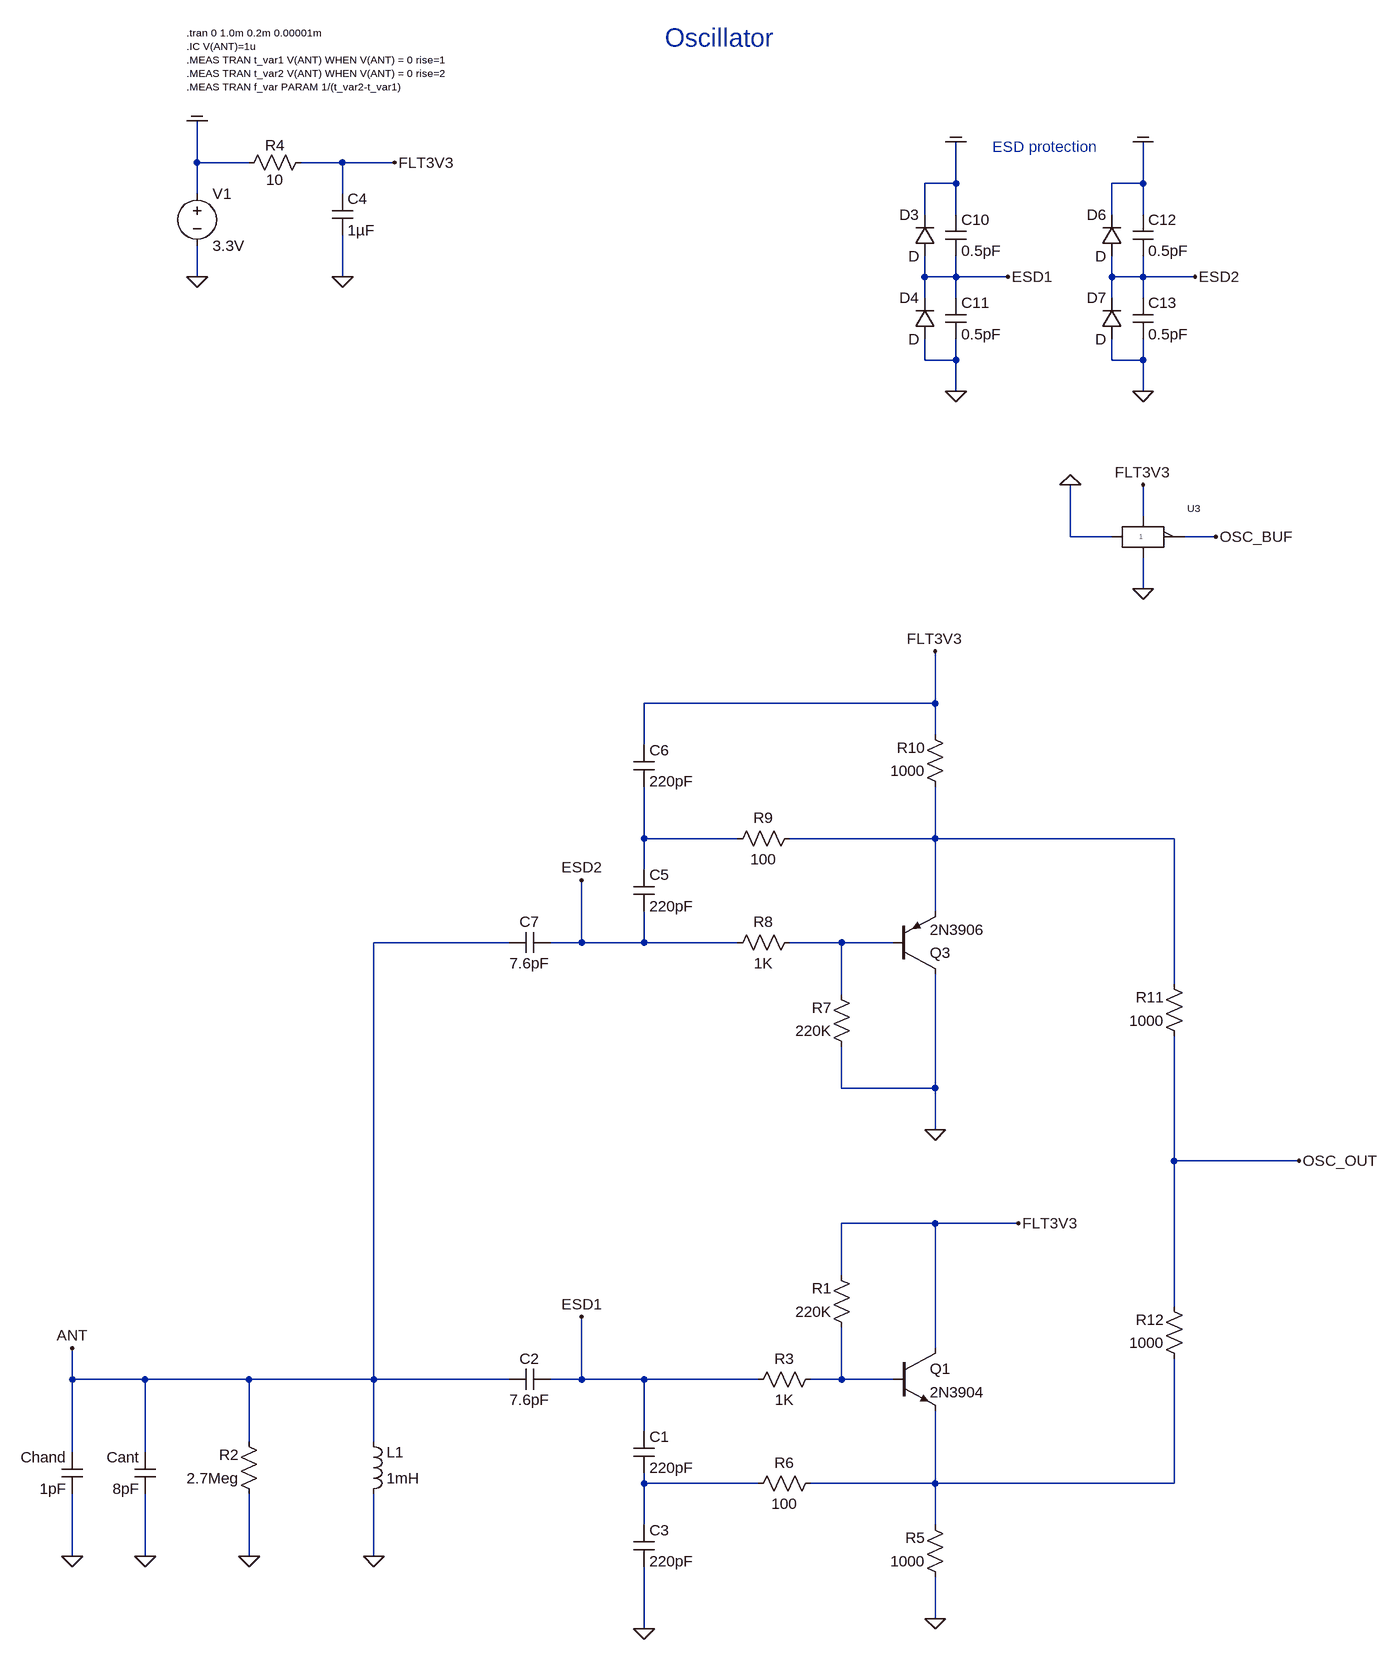
[diagram p0: schematic 2020_npn_osc_v2.asc]
2020_npn_osc_v2.asc, the LTspice schematic file:
Version 4
SHEET 1 2908 1940
WIRE -1056 -336 -1056 -400
WIRE -976 -336 -1056 -336
WIRE -832 -336 -896 -336
WIRE -752 -336 -832 -336
WIRE 112 -304 112 -368
WIRE 112 -304 64 -304
WIRE 400 -304 400 -368
WIRE 400 -304 352 -304
WIRE -1056 -288 -1056 -336
WIRE -832 -288 -832 -336
WIRE 64 -256 64 -304
WIRE 112 -256 112 -304
WIRE 352 -256 352 -304
WIRE 400 -256 400 -304
WIRE -1056 -160 -1056 -208
WIRE -832 -160 -832 -224
WIRE 64 -160 64 -192
WIRE 112 -160 112 -192
WIRE 112 -160 64 -160
WIRE 192 -160 112 -160
WIRE 352 -160 352 -192
WIRE 400 -160 400 -192
WIRE 400 -160 352 -160
WIRE 480 -160 400 -160
WIRE 64 -128 64 -160
WIRE 112 -128 112 -160
WIRE 352 -128 352 -160
WIRE 400 -128 400 -160
WIRE 64 -32 64 -64
WIRE 112 -32 112 -64
WIRE 112 -32 64 -32
WIRE 352 -32 352 -64
WIRE 400 -32 400 -64
WIRE 400 -32 352 -32
WIRE 112 16 112 -32
WIRE 400 16 400 -32
WIRE 400 208 400 160
WIRE 288 240 288 160
WIRE 352 240 288 240
WIRE 512 240 464 240
WIRE 400 320 400 272
WIRE 80 496 80 416
WIRE 80 496 -368 496
WIRE 80 544 80 496
WIRE -368 560 -368 496
WIRE -368 704 -368 624
WIRE -224 704 -368 704
WIRE 80 704 80 624
WIRE 80 704 -144 704
WIRE 448 704 80 704
WIRE -368 752 -368 704
WIRE 80 816 80 704
WIRE -576 864 -784 864
WIRE -464 864 -464 768
WIRE -464 864 -512 864
WIRE -368 864 -368 816
WIRE -368 864 -464 864
WIRE -224 864 -368 864
WIRE -64 864 -144 864
WIRE 16 864 -64 864
WIRE 448 928 448 704
WIRE -64 944 -64 864
WIRE -64 1088 -64 1024
WIRE 80 1088 80 912
WIRE 80 1088 -64 1088
WIRE 80 1152 80 1088
WIRE 448 1200 448 1008
WIRE 640 1200 448 1200
WIRE 80 1296 -64 1296
WIRE 208 1296 80 1296
WIRE -64 1376 -64 1296
WIRE 448 1424 448 1200
WIRE 80 1488 80 1296
WIRE -1248 1536 -1248 1488
WIRE -1136 1536 -1248 1536
WIRE -976 1536 -1136 1536
WIRE -784 1536 -784 864
WIRE -784 1536 -976 1536
WIRE -576 1536 -784 1536
WIRE -464 1536 -464 1440
WIRE -464 1536 -512 1536
WIRE -368 1536 -464 1536
WIRE -192 1536 -368 1536
WIRE -64 1536 -64 1456
WIRE -64 1536 -112 1536
WIRE 16 1536 -64 1536
WIRE -368 1616 -368 1536
WIRE -976 1632 -976 1536
WIRE -784 1632 -784 1536
WIRE -1248 1648 -1248 1536
WIRE -1136 1648 -1136 1536
WIRE -368 1696 -368 1680
WIRE -192 1696 -368 1696
WIRE 80 1696 80 1584
WIRE 80 1696 -112 1696
WIRE 448 1696 448 1504
WIRE 448 1696 80 1696
WIRE -368 1760 -368 1696
WIRE 80 1760 80 1696
WIRE -1248 1808 -1248 1712
WIRE -1136 1808 -1136 1712
WIRE -976 1808 -976 1712
WIRE -784 1808 -784 1712
WIRE 80 1904 80 1840
WIRE -368 1920 -368 1824
FLAG -1056 -160 0
FLAG -1248 1808 0
FLAG -1248 1488 ANT
FLAG -1056 -400 COM
FLAG 112 16 0
FLAG 112 -368 COM
FLAG 192 -160 ESD1
FLAG 400 16 0
FLAG 400 -368 COM
FLAG 480 -160 ESD2
FLAG -1136 1808 0
FLAG -464 1440 ESD1
FLAG 512 240 OSC_BUF
FLAG -832 -160 0
FLAG 400 320 0
FLAG -976 1808 0
FLAG -784 1808 0
FLAG -368 1920 0
FLAG 80 1904 0
FLAG -752 -336 FLT3V3
FLAG 400 160 FLT3V3
FLAG 208 1296 FLT3V3
FLAG 640 1200 OSC_OUT
FLAG -464 768 ESD2
FLAG 288 160 0
FLAG 80 1152 0
FLAG 80 416 FLT3V3
SYMBOL voltage -1056 -304 R0
WINDOW 123 0 0 Left 2
WINDOW 39 0 0 Left 2
SYMATTR InstName V1
SYMATTR Value 3.3V
SYMBOL ind -800 1728 M180
WINDOW 0 36 80 Left 2
WINDOW 3 36 40 Left 2
SYMATTR InstName L1
SYMATTR Value 1mH
SYMATTR SpiceLine Ipk=0.1 Rser=101 Rpar=2Meg Cpar=1.286pF
SYMBOL cap -1232 1648 M0
SYMATTR InstName Chand
SYMATTR Value 1pF
SYMBOL diode 80 -192 R180
WINDOW 0 24 64 Left 2
WINDOW 3 24 0 Left 2
SYMATTR InstName D3
SYMBOL diode 80 -64 R180
WINDOW 0 24 64 Left 2
WINDOW 3 24 0 Left 2
SYMATTR InstName D4
SYMBOL cap 96 -256 R0
SYMATTR InstName C10
SYMATTR Value 0.5pF
SYMBOL cap 96 -128 R0
SYMATTR InstName C11
SYMATTR Value 0.5pF
SYMBOL diode 368 -192 R180
WINDOW 0 24 64 Left 2
WINDOW 3 24 0 Left 2
SYMATTR InstName D6
SYMBOL diode 368 -64 R180
WINDOW 0 24 64 Left 2
WINDOW 3 24 0 Left 2
SYMATTR InstName D7
SYMBOL cap 384 -256 R0
SYMATTR InstName C12
SYMATTR Value 0.5pF
SYMBOL cap 384 -128 R0
SYMATTR InstName C13
SYMATTR Value 0.5pF
SYMBOL cap -1120 1648 M0
SYMATTR InstName Cant
SYMATTR Value 8pF
SYMBOL res -880 -352 R90
WINDOW 0 5 56 VBottom 2
WINDOW 3 27 56 VTop 2
SYMATTR InstName R4
SYMATTR Value 10
SYMBOL cap -848 -288 R0
SYMATTR InstName C4
SYMATTR Value 1µF
SYMBOL SBORKA\\Logika\\74AHC1G04 400 192 R0
SYMATTR InstName U3
SYMBOL res -48 1472 R180
WINDOW 0 31 76 Left 2
WINDOW 3 31 40 Left 2
SYMATTR InstName R1
SYMATTR Value 220K
SYMBOL res -960 1728 R180
WINDOW 0 31 76 Left 2
WINDOW 3 31 40 Left 2
SYMATTR InstName R2
SYMATTR Value 2.7Meg
SYMBOL cap -384 1616 R0
SYMATTR InstName C1
SYMATTR Value 220pF
SYMBOL cap -512 1520 R90
WINDOW 0 0 32 VBottom 2
WINDOW 3 32 32 VTop 2
SYMATTR InstName C2
SYMATTR Value 7.6pF
SYMBOL cap -384 1760 R0
SYMATTR InstName C3
SYMATTR Value 220pF
SYMBOL npn 16 1488 R0
SYMATTR InstName Q1
SYMATTR Value 2N3904
SYMBOL res -208 1552 R270
WINDOW 0 32 56 VTop 2
WINDOW 3 0 56 VBottom 2
SYMATTR InstName R3
SYMATTR Value 1K
SYMBOL res 96 1856 R180
WINDOW 0 31 76 Left 2
WINDOW 3 31 40 Left 2
SYMATTR InstName R5
SYMATTR Value 1000
SYMBOL res -208 1712 R270
WINDOW 0 32 56 VTop 2
WINDOW 3 0 56 VBottom 2
SYMATTR InstName R6
SYMATTR Value 100
SYMBOL pnp 16 912 M180
SYMATTR InstName Q3
SYMATTR Value 2N3906
SYMBOL res -48 1040 R180
WINDOW 0 31 76 Left 2
WINDOW 3 31 40 Left 2
SYMATTR InstName R7
SYMATTR Value 220K
SYMBOL res -240 880 R270
WINDOW 0 32 56 VTop 2
WINDOW 3 0 56 VBottom 2
SYMATTR InstName R8
SYMATTR Value 1K
SYMBOL res -240 720 R270
WINDOW 0 32 56 VTop 2
WINDOW 3 0 56 VBottom 2
SYMATTR InstName R9
SYMATTR Value 100
SYMBOL res 96 640 R180
WINDOW 0 31 76 Left 2
WINDOW 3 31 40 Left 2
SYMATTR InstName R10
SYMATTR Value 1000
SYMBOL cap -384 752 R0
SYMATTR InstName C5
SYMATTR Value 220pF
SYMBOL cap -384 560 R0
SYMATTR InstName C6
SYMATTR Value 220pF
SYMBOL cap -512 848 R90
WINDOW 0 0 32 VBottom 2
WINDOW 3 32 32 VTop 2
SYMATTR InstName C7
SYMATTR Value 7.6pF
SYMBOL res 464 1024 R180
WINDOW 0 31 76 Left 2
WINDOW 3 31 40 Left 2
SYMATTR InstName R11
SYMATTR Value 1000
SYMBOL res 464 1520 R180
WINDOW 0 31 76 Left 2
WINDOW 3 31 40 Left 2
SYMATTR InstName R12
SYMATTR Value 1000
TEXT -1072 -536 Left 1 !.tran 0 1.0m 0.2m 0.00001m\n.IC V(ANT)=1u\n.MEAS TRAN t_var1 V(ANT) WHEN V(ANT) = 0 rise=1\n.MEAS TRAN t_var2 V(ANT) WHEN V(ANT) = 0 rise=2\n.MEAS TRAN f_var PARAM 1/(t_var2-t_var1)
TEXT 168 -360 Left 2 ;ESD protection
TEXT -336 -528 Left 4 ;Oscillator

The netlist it stands for:
* 2020_npn_osc_v2.asc
V1 COM 0 3.3V
L1 0 ANT 1mH Ipk=0.1 Rser=101 Rpar=2Meg Cpar=1.286pF
Chand ANT 0 1pF
D3 ESD1 COM D
D4 0 ESD1 D
C10 COM ESD1 0.5pF
C11 ESD1 0 0.5pF
D6 ESD2 COM D
D7 0 ESD2 D
C12 COM ESD2 0.5pF
C13 ESD2 0 0.5pF
Cant ANT 0 8pF
R4 FLT3V3 COM 10
C4 FLT3V3 0 1µF
XU3 0 OSC_BUF FLT3V3 0 74AHC1G04  ; pins in out vcc gnd
R1 N004 FLT3V3 220K
R2 0 ANT 2.7Meg
C1 ESD1 N005 220pF
C2 ESD1 ANT 7.6pF
C3 N005 0 220pF
Q1 FLT3V3 N004 N006 0 2N3904
R3 ESD1 N004 1K
R5 0 N006 1000
R6 N005 N006 100
Q3 0 N003 N002 0 2N3906
R7 0 N003 220K
R8 ESD2 N003 1K
R9 N001 N002 100
R10 N002 FLT3V3 1000
C5 N001 ESD2 220pF
C6 FLT3V3 N001 220pF
C7 ESD2 ANT 7.6pF
R11 OSC_OUT N002 1000
R12 N006 OSC_OUT 1000
.model D D
.lib standard.dio
.model NPN NPN
.model PNP PNP
.lib standard.bjt
.tran 0 1.0m 0.2m 0.00001m
.IC V(ANT)=1u
.MEAS TRAN t_var1 V(ANT) WHEN V(ANT) = 0 rise=1
.MEAS TRAN t_var2 V(ANT) WHEN V(ANT) = 0 rise=2
.MEAS TRAN f_var PARAM 1/(t_var2-t_var1)
* ESD protection
* Oscillator
.lib 74AHC1G04.cir
.backanno
.end